# EAGLE design r1 (EAGLE 5.06)
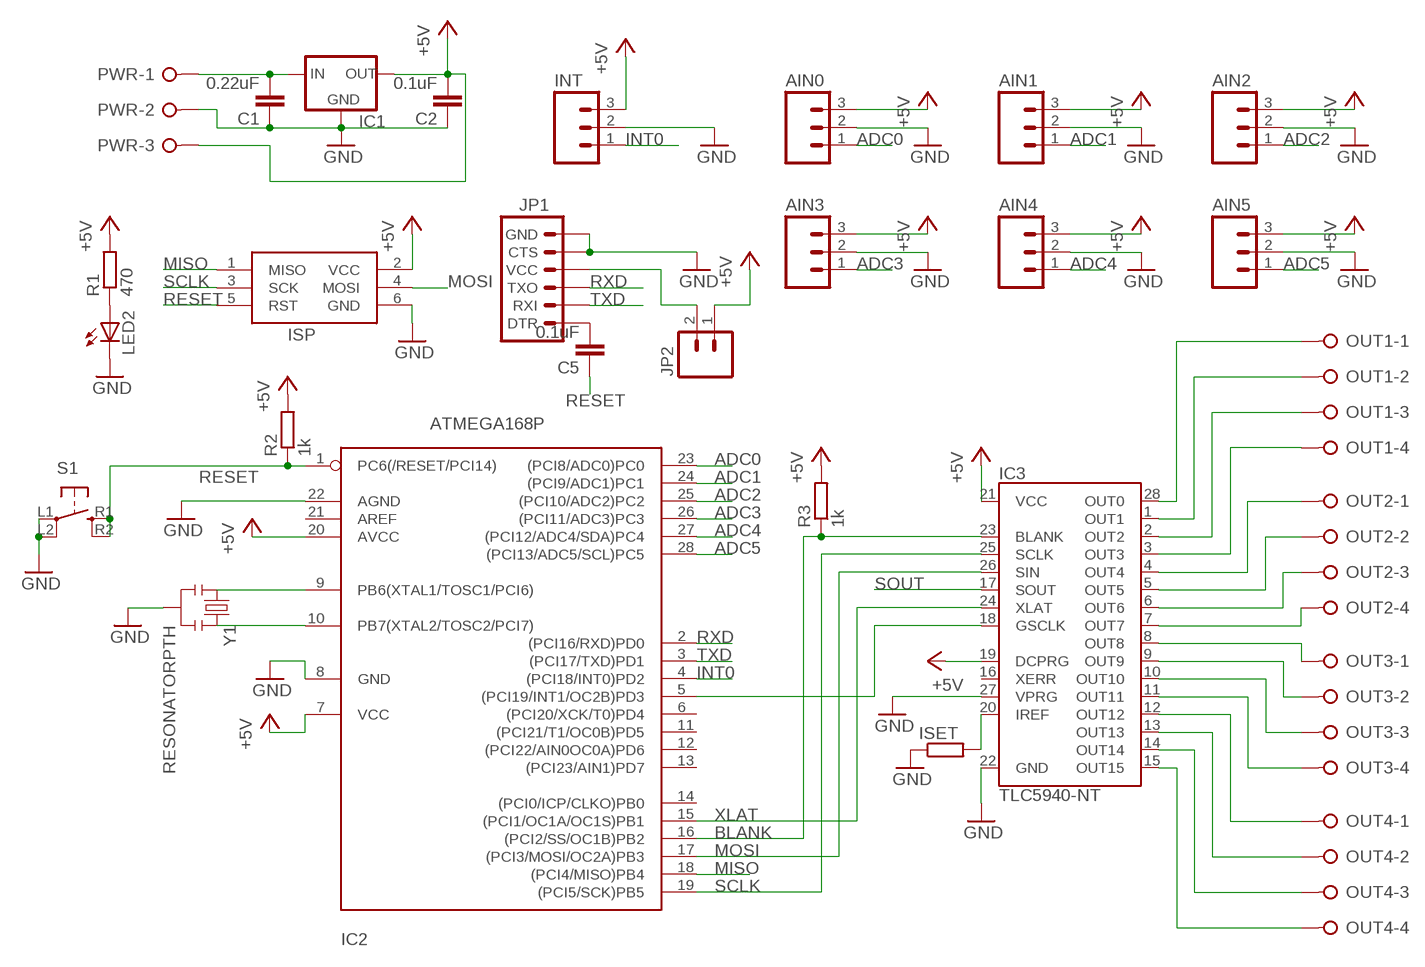
[diagram p0: schematic, sheet 1]

## Parts
AIN0  M03PTH  [1X03]
AIN1  M03PTH  [1X03]
AIN2  M03PTH  [1X03]
AIN3  M03PTH  [1X03]
AIN4  M03PTH  [1X03]
AIN5  M03PTH  [1X03]
C1  0.22uF  C-EU050-025X075  [C050-025X075]
C2  0.1uF  C-EU050-025X075  [C050-025X075]
C5  0.1uF  C-EU050-025X075  [C050-025X075]
IC1  V_REG_78XXSINK  [TO220-IGO]
IC2  ATMEGA168P  [X-DIL28-3]
IC3  TLC5940-NT  [X-DIL28-3]
INT  M03PTH  [1X03]
ISET  R-EU_0204/7  [0204/7]
ISP  AVRISP-6  [AVRISP]
JP1  ARDUINO_SERIAL_PROGRAMPTH  [1X06]
JP2  M02LOCK  [1X02_LOCK]
LED2  LED5MM  [LED5MM]
OUT1  W237-04P  [W237-4P]
OUT2  W237-04P  [W237-4P]
OUT3  W237-04P  [W237-4P]
OUT4  W237-04P  [W237-4P]
PWR  W237-03P  [W237-133]
R1  470  R-EU_0204/7  [0204/7]
R2  1k  R-EU_0204/7  [0204/7]
R3  1k  R-EU_0204/7  [0204/7]
S1  SWITCH-MOMENTARY-2PTH  [TACTILE-PTH]
Y1  RESONATORPTH  [RESONATOR-PTH]

## Nets
+5V: AIN0.3 AIN1.3 AIN2.3 AIN3.3 AIN4.3 AIN5.3 C2.2 IC1.OUT IC2.7(VCC) IC2.20(AVCC) IC3.19(DCPRG) IC3.21(VCC) INT.3 ISP.2(VCC) JP2.1 PWR.3 R1.2 R2.2 R3.2
ADC0: AIN0.1 IC2.23((PCI8/ADC0)PC0)
ADC1: AIN1.1 IC2.24((PCI9/ADC1)PC1)
ADC2: AIN2.1 IC2.25((PCI10/ADC2)PC2)
ADC3: AIN3.1 IC2.26((PCI11/ADC3)PC3)
ADC4: AIN4.1 IC2.27((PCI12/ADC4/SDA)PC4)
ADC5: AIN5.1 IC2.28((PCI13/ADC5/SCL)PC5)
BLANK: IC2.16((PCI2/SS/OC1B)PB2) IC3.23(BLANK) R3.1
GND: AIN0.2 AIN1.2 AIN2.2 AIN3.2 AIN4.2 AIN5.2 C1.1 C2.1 IC1.GND IC2.8(GND) IC2.22(AGND) IC3.22(GND) IC3.27(VPRG) INT.2 ISET.1 ISP.6(GND) JP1.5(CTS) JP1.6(GND) LED2.K(C) PWR.2 S1.L1 S1.L2 Y1.2
GSCLK: IC2.5((PCI19/INT1/OC2B)PD3) IC3.18(GSCLK)
INT0: IC2.4((PCI18/INT0)PD2) INT.1
MISO: IC2.18((PCI4/MISO)PB4) ISP.1(MISO)
MOSI: IC2.17((PCI3/MOSI/OC2A)PB3) IC3.26(SIN) ISP.4(MOSI)
N$1: C5.2 JP1.1(DTR)
N$2: C1.2 IC1.IN PWR.1
N$3: IC2.9(PB6(XTAL1/TOSC1/PCI6)) Y1.1
N$4: IC2.10(PB7(XTAL2/TOSC2/PCI7)) Y1.3
N$5: LED2.A R1.1
N$6: IC3.3(OUT3) OUT1.4
N$7: JP1.4(VCC) JP2.2
N$8: IC3.2(OUT2) OUT1.3
N$9: IC3.1(OUT1) OUT1.2
N$12: IC3.20(IREF) ISET.2
N$13: IC3.28(OUT0) OUT1.1
N$14: IC3.8(OUT8) OUT3.1
N$15: IC3.9(OUT9) OUT3.2
N$16: IC3.10(OUT10) OUT3.3
N$17: IC3.11(OUT11) OUT3.4
N$18: IC3.7(OUT7) OUT2.4
N$19: IC3.6(OUT6) OUT2.3
N$20: IC3.5(OUT5) OUT2.2
N$21: IC3.4(OUT4) OUT2.1
N$22: IC3.12(OUT12) OUT4.1
N$23: IC3.13(OUT13) OUT4.2
N$24: IC3.14(OUT14) OUT4.3
N$25: IC3.15(OUT15) OUT4.4
RESET: C5.1 IC2.1(PC6(/RESET/PCI14)) ISP.5(RST) R2.1 S1.R1 S1.R2
RXD: IC2.2((PCI16/RXD)PD0) JP1.3(TXO)
SCLK: IC2.19((PCI5/SCK)PB5) IC3.25(SCLK) ISP.3(SCK)
SOUT: IC3.17(SOUT)
TXD: IC2.3((PCI17/TXD)PD1) JP1.2(RXI)
XLAT: IC2.15((PCI1/OC1A/OC1S)PB1) IC3.24(XLAT)
Unconnected: IC2.6((PCI20/XCK/T0)PD4) IC2.11((PCI21/T1/OC0B)PD5) IC2.12((PCI22/AIN0OC0A)PD6) IC2.13((PCI23/AIN1)PD7) IC2.14((PCI0/ICP/CLKO)PB0) IC2.21(AREF) IC3.16(XERR)

## Library data of the parts
AIN0 AIN1-AIN5 INT = SparkFun:M03: Header 3 Standard 3-pin 0.1" header. Use with straight break away headers (SKU : PRT-00116), right angle break away headers (PRT-00553), swiss pins (PRT-00743), machine pins (PRT-00117), and female headers (PRT-00115). Molex polarized connector foot print use with SKU : PRT-08232 with associated crimp pins and housings.
C1 C2 C5 = rcl:C-EU: CAPACITOR, European symbol
IC1 = a-new-library:V_REG_78XX: Voltage Regulator Standard 7805 5V regulator. IGO (Input Ground Output). Spark Fun Electronics SKU : COM-00107
IC2 = a-new-library:ATMEGA168*P: MICROCONTROLLER 16 kBytes FLASH 1 kBytes SRAM 512 Bytes EEPROM USART 8-channel 10 bit ADC
IC3 = a-new-library:TLC5940: TI TLC5940 16-channel LED Driver with Dot Correction and Grayscale PWM Control The TLC5940 is a 16-channel, constant-current sink LED driver. Each channel has an individually adjustable 4096-step grayscale PWM brightness control and a 64-step, constant-current sink (dot correction). The dot correction adjusts the brightness variations between LED channels and other LED drivers. The dot correction data is stored in an integrated EEPROM. Both grayscale control and dot correction are accessible via a serial interface. A single external resistor sets the maximum current value of all 16 channels. Packages: 28-pin HTSSOP 32-pin 5x5mm QFN 28-pin DIP
ISET R1-R3 = rcl:R-EU_: RESISTOR, European symbol
ISP = adafruit:AVRISP: AVR ISP HEADER Standard 6 pin header for AVR programming
JP1 = SparkFun:ARDUINO_SERIAL_PROGRAM
JP2 = a-new-library:M02: Header 2 Standard 2-pin 0.1" header. Use with straight break away headers (SKU : PRT-00116), right angle break away headers (PRT-00553), swiss pins (PRT-00743), machine pins (PRT-00117), and female headers (PRT-00115). Molex polarized connector foot print use with SKU : PRT-08233 with associated crimp pins and housings.
LED2 = SparkFun:LED: LEDs Standard schematic elements and footprints for 5mm, 3mm, 1206, and 0603 sized LEDs. 5mm - Spark Fun Electronics SKU : COM-00529 (and others)
OUT1-OUT4 = a-new-library:W237-04P: WAGO SREW CLAMP; OC_FARNELL: unknown; OC_NEWARK: unknown
PWR = con-wago-508:W237-03P: WAGO SREW CLAMP; OC_FARNELL: unknown; OC_NEWARK: unknown
S1 = a-new-library:SWITCH-MOMENTARY-2
Y1 = SparkFun:RESONATOR: Resonator Small SMD resonator. This is the itty bitty 10/20MHz resonators with built in caps. CSTCE10M0G55 and CSTCE20M0V53. Footprint has been reviewed closely but hasn't been tested yet.

## Board
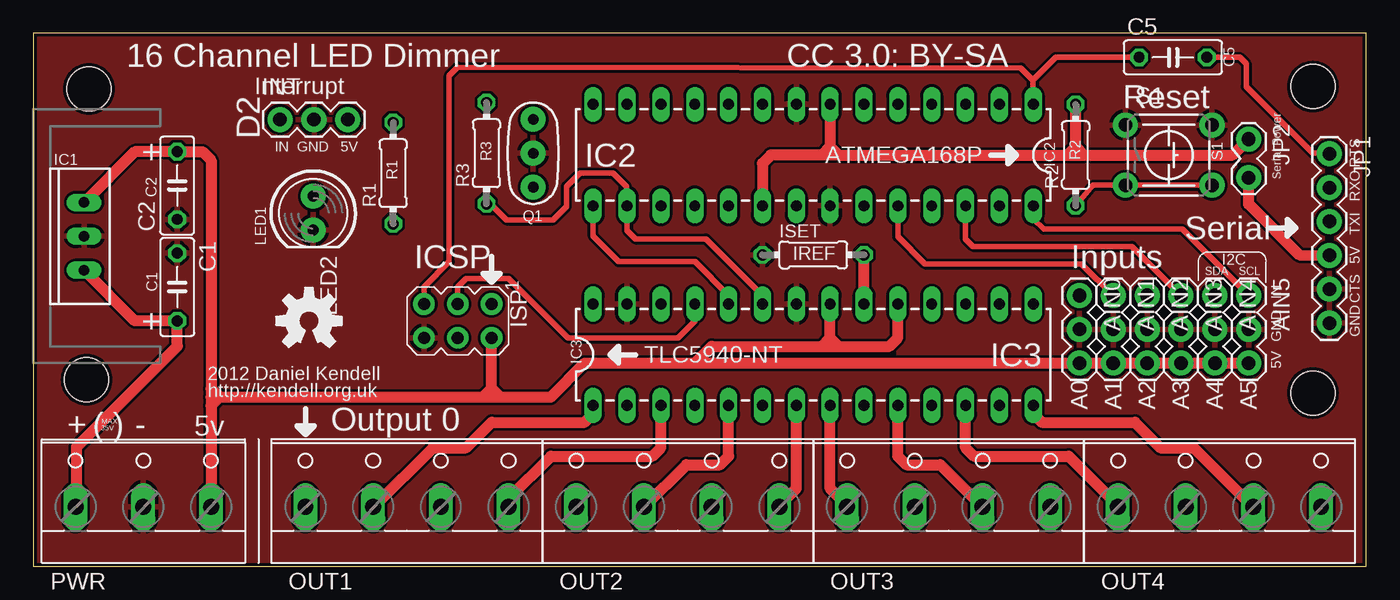
[diagram p1: board, top side]
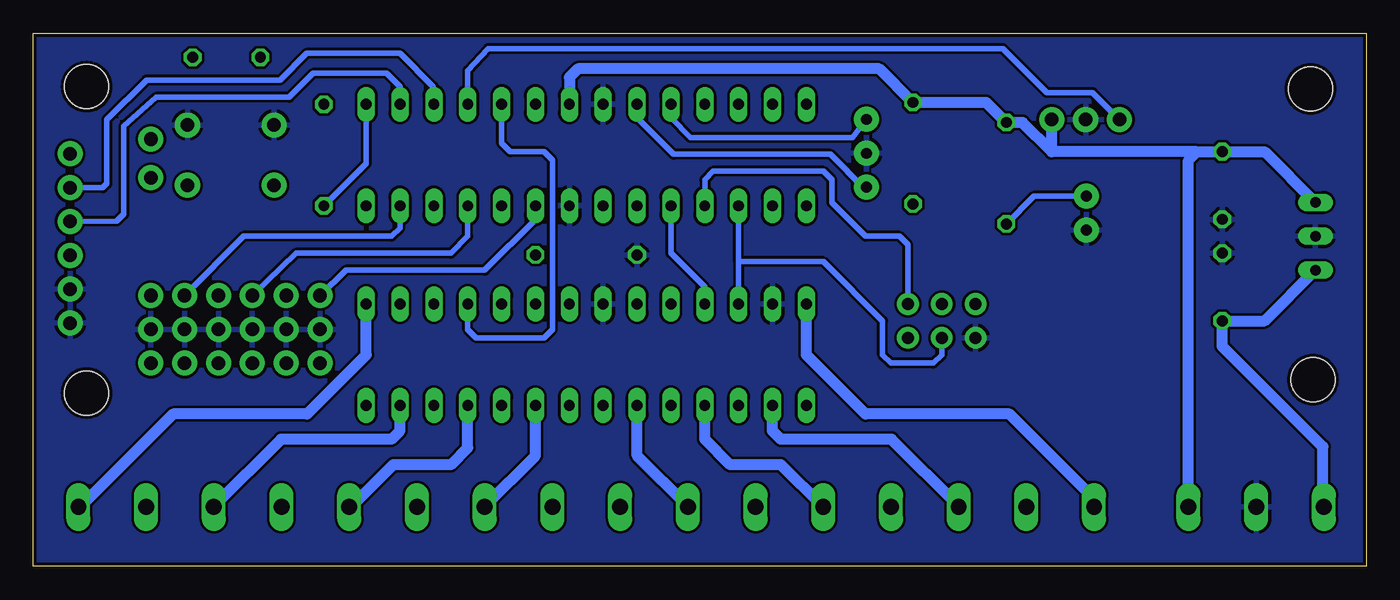
[diagram p2: board, bottom side, seen from below]

Size 100 x 40 mm. Coordinates in mm from the lower left corner, seen from the top.
Outline: 0,0 100,0 100,40 0,39.99 0,0
Copper layers (1*16): Top 0.035mm / dielectric 1.5mm / Bottom 0.035mm
Design rules "pcbtrain": minimum track width 0.2mm, minimum drill 0.4mm, track to track 0.2mm, track to pad 0.2mm, pad to pad 0.2mm, via to via 0.2mm, smd to smd 0mil, copper to edge 10mil, drill to drill 0.2mm, minimum pad ring 10mil, minimum via ring 10mil, stop-mask expansion 0.125mm, vias tented up to drill 0mil, thermal gap 10mil

### Footprints (pad centres in the part's own frame; a part is rotated, then mirrored left to right if it is on the bottom)
1X03 = drill 1.016 pad 1.88 round: 1 0,0; 2 2.54,0; 3 5.08,0
C050-025X075 = drill 0.813 octagon: 1 -2.54,0; 2 2.54,0
TO220-IGO = drill 0.8 long: GND 0,0; IN -2.54,0; OUT 2.54,0
X-DIL28-3 = drill 0.813 long: 1 -16.51,-3.81; 2 -13.97,-3.81; 3 -11.43,-3.81; 4 -8.89,-3.81; 5 -6.35,-3.81; 6 -3.81,-3.81; 7 -1.27,-3.81; 8 1.27,-3.81; 9 3.81,-3.81; 10 6.35,-3.81; 11 8.89,-3.81; 12 11.43,-3.81; 13 13.97,-3.81; 14 16.51,-3.81; 15 16.51,3.81; 16 13.97,3.81; 17 11.43,3.81; 18 8.89,3.81; 19 6.35,3.81; 20 3.81,3.81; 21 1.27,3.81; 22 -1.27,3.81; 23 -3.81,3.81; 24 -6.35,3.81; 25 -8.89,3.81; 26 -11.43,3.81; 27 -13.97,3.81; 28 -16.51,3.81
0204/7 = drill 0.813 octagon: 1 -3.81,0; 2 3.81,0
AVRISP = drill 0.9 pad 1.626 round: 1 -1.27,2.54; 2 1.27,2.54; 3 -1.27,0; 4 1.27,0; 5 -1.27,-2.54; 6 1.27,-2.54
1X06 = drill 1.016 pad 1.88 round: 1 0,0; 2 2.54,0; 3 5.08,0; 4 7.62,0; 5 10.16,0; 6 12.7,0
1X02_LOCK = drill 1.016 pad 1.88 round: 1 -0.178,0; 2 2.718,0
LED5MM = drill 0.813 pad 1.88 round: A -1.27,0; K 1.27,0
W237-4P = drill 1.194 long: 1 -7.62,-0.635; 2 -2.54,-0.635; 3 2.54,-0.635; 4 7.62,-0.635
W237-133 = drill 1.194 long: 1 -5.08,-0.635; 2 0,-0.635; 3 5.08,-0.635
TACTILE-PTH = drill 1.016 pad 1.88 round: L1 -2.261,3.251; L2 -2.261,-3.251; R1 2.261,3.251; R2 2.261,-3.251
STAND-OFF = hole 3.302: 0,0
RESONATOR-PTH = drill 0.8 pad 1.88 round: 1 -2.54,0; 2 0,0; 3 2.54,0

### Placement (x,y rotation side)
AIN0  78.49,20.32 270 top
AIN1  81.03,20.32 270 top
AIN2  83.57,20.32 270 top
AIN3  86.11,20.32 270 top
AIN4  88.65,20.32 270 top
AIN5  91.19,20.32 270 top
C1  10.79,20.95 270 top
C2  10.79,28.57 90 top
C5  85.5,38.2 0 top
IC1  3.81,24.77 90 top
IC2  58.52,30.86 180 top
IC3  58.52,15.88 0 top
INT  18.51,33.53 0 top
ISET  58.52,23.37 0 top
ISP  31.84,18.41 270 top
JP1  97.24,30.95 270 top
JP2  91.19,31.88 270 top
LED2  21,26.5 270 top
OUT1  28.04,5.08 0 top
OUT2  48.35,5.08 0 top
OUT3  68.67,5.08 0 top
OUT4  89,5.08 0 top
PWR  8.26,5.08 0 top
R1  27,29.5 90 top
R2  78.2,30.86 90 top
R3  34,31 90 top
S1  85.19,30.86 270 top
U$1  [OSHW-LOGO-M]  20.68,18.41 0 top
U$2  [STAND-OFF]  96,13 0 top
U$3  [STAND-OFF]  4,14 0 top
U$4  [STAND-OFF]  4.17,35.83 0 top
U$5  [STAND-OFF]  96,36 0 top
Y1  37.5,31 90 top

### Tracks (layer width: path | path; a pad name or v marks a point on that pad's centre or on a via)
+5V
  Top 0.813: 78.2,31.5 R2.2 | 77.56,30.86 78.2,31.5 | 60.42,30.86 77.56,30.86 | 59.78,31.5 60.42,30.86 | 59.15,30.86 55.34,30.86 54.7,30.23 IC2.20 | 59.78,31.5 59.15,30.86 | IC2.7 59.78,31.5 | IC1.OUT 7.62,31.11 C2.2 12.7,31.11 13.34,30.48 13.34,13.34 | AIN5.3 AIN4.3 AIN3.3 AIN2.3 AIN1.3 AIN0.3 49.62,15.24 | 49.62,15.24 41.37,15.24 38.83,12.7 35.02,12.7 | 13.34,12.7 13.97,12.7 | 13.97,12.7 33.75,12.7 | 33.75,12.7 34.38,12.7 | 34.38,12.7 35.02,12.7 | 13.34,12.06 13.34,4.5 | 13.34,12.7 13.34,12.06 | 13.34,13.34 13.34,12.7 | 59.78,17.14 IC3.21 | 59.15,16.51 50.9,16.51 49.62,15.24 | 59.15,16.51 59.78,17.14 | 59.78,17.14 60.42,16.51 | 60.42,16.51 64.23,16.51 64.86,17.14 IC3.19 | 34.38,12.7 34.38,13.34 | 34.38,13.34 ISP.2 | 13.97,12.7 13.34,12.06 | 13.34,13.34 13.97,12.7 | 33.75,12.7 34.38,13.34 | 34.38,13.34 35.02,12.7 | 59.15,16.51 60.42,16.51 | 60.42,30.86 59.15,30.86 | 78.2,31.5 78.83,30.86 | 77.56,30.86 78.83,30.86 | 78.83,30.86 89.99,30.86 JP2.1
  Bottom 0.813: 12.7,31.11 C2.2 7.62,31.11 IC1.OUT | IC2.7 59.78,36.7 59.15,37.34 36.53,37.34 R3.2 28.5,34.81 R1.2 25.79,33.31 23.59,31.11 | 12.7,31.11 13.34,30.48 PWR.3 | 23.59,31.11 INT.3 | 12.7,31.11 23.59,31.11
ADC0
  Bottom 0.406: AIN0.1 76.54,22.23 66.14,22.23 62.33,26.04 IC2.23
ADC1
  Top 0.406: IC2.24 64.86,24.73 66.9,22.7 78.65,22.7 AIN1.1
ADC2
  Bottom 0.406: AIN2.1 80.26,23.5 68.67,23.5 67.41,24.77 IC2.25
ADC3
  Top 0.406: IC2.26 69.94,24.55 70.5,24 82.43,24 AIN3.1
ADC4
  Bottom 0.406: AIN4.1 84.2,24.77 73.12,24.77 72.48,25.4 IC2.27
ADC5
  Top 0.406: IC2.28 75.03,26.07 75.8,25.3 86.21,25.3 AIN5.1
BLANK
  Top 0.406: IC3.23 54.7,20.32 50.46,24.57 45.18,24.57 44.55,25.2 IC2.16 44.5,27.1 44.5,28.5 43.5,29.5 41,29.5 40,28.5 40,27 39,26 35.5,26 34.31,27.19 R3.1
GND
  pour Bottom: 0,40.01 0,0 100,0 100,40
  pour Top: 0,40.01 100,40 100,0 0,0
GSCLK
  Bottom 0.406: IC3.18 67.41,17.78 66.77,17.14 61.69,17.14 61.05,17.78 61.05,30.48 61.69,31.11 64.23,31.11 64.86,31.75 IC2.5
INT0
  Bottom 0.406: IC2.4 67.41,37.21 65.88,38.86 27.27,38.86 23.97,35.56 20.54,35.56 INT.1
MISO
  Bottom 0.406: ISP.1 34.38,24.13 35.02,24.77 37.56,24.77 40.1,27.3 40.1,29.01 40.73,29.64 48.99,29.64 49.62,29.01 IC2.18
MOSI
  Bottom 0.406: ISP.4 31.84,15.88 32.48,15.24 35.66,15.24 36.29,15.88 36.29,18.41 40.73,22.86 47.09,22.86 | 47.09,22.86 IC3.26 | 47.09,22.86 IC2.17
N$1
  Top 0.406: C5.2 90.5,38.2 91,37.7 91,36 96.01,30.99 97.28,30.99 JP1.1
N$2
  Top 0.813: IC1.IN 7.62,18.41 C1.2 10.79,16.51 3.25,8.97 3.25,4.53 PWR.1
  Bottom 0.813: IC1.IN 7.62,18.41 C1.2 10.79,16.51 3.25,8.97 3.25,4.53 PWR.1
N$3
  Bottom 0.406: IC2.9 54.7,33.66 51.97,30.91 40.2,30.91 37.64,28.36 Y1.1
N$4
  Bottom 0.406: IC2.10 52.16,33.66 50.7,32.19 38.55,32.19 Y1.3
N$5
  Bottom 0.406: LED2.A 24.92,27.77 R1.1
N$6
  Top 0.813: IC3.3 47.09,8.89 46.45,8.26 38.83,8.26 35.66,5.08 OUT1.4
N$7
  Top 0.813: JP2.2 91.19,27.18 95,23.37 JP1.4
N$8
  Bottom 0.813: IC3.2 44.55,10.16 43.91,9.53 35.62,9.53 30.57,4.49 OUT1.3
N$9
  Top 0.813: IC3.1 42.01,11.43 41.37,10.79 34.38,10.79 32.48,8.89 29.98,8.89 25.54,4.45 OUT1.2
N$12
  Top 0.813: IC3.20 ISET.2
N$13
  Bottom 0.813: IC3.28 42.01,15.88 37.56,11.43 26.77,11.43 20.41,5.08 OUT1.1
N$14
  Top 0.813: IC3.8 59.78,5.83 61.05,4.57 OUT3.1
N$15
  Bottom 0.813: IC3.9 62.33,8.29 66.14,4.49 OUT3.2
N$16
  Top 0.813: IC3.10 64.86,8.26 65.5,7.62 68.04,7.62 OUT3.3
N$17
  Bottom 0.813: IC3.11 67.41,8.89 68.67,7.62 73,7.62 76.17,4.45 OUT3.4
N$18
  Top 0.813: IC3.7 57.24,5.83 55.98,4.57 OUT2.4
N$19
  Bottom 0.813: IC3.6 54.7,8.29 50.9,4.49 OUT2.3
N$20
  Top 0.813: IC3.5 52.16,8.26 51.53,7.62 48.99,7.62 OUT2.2
N$21
  Bottom 0.813: IC3.4 49.62,9.53 47.72,7.62 43.91,7.62 OUT2.1
N$22
  Top 0.813: IC3.12 69.94,8.89 70.58,8.26 77.69,8.26 81.38,4.57 OUT4.1
N$23
  Bottom 0.813: IC3.13 72.48,10.16 73.12,9.53 81.42,9.53 86.45,4.49 OUT4.2
N$24
  Top 0.813: IC3.14 75.03,11.43 75.66,10.79 82.64,10.79 84.55,8.89 87.05,8.89 91.5,4.45 OUT4.3
N$25
  Bottom 0.813: IC3.15 75.03,15.88 79.47,11.43 89.51,11.43 96.5,4.45 OUT4.4
RESET
  Top 0.406: 75,36.5 74.1,37.4 31.84,37.47 31.21,36.83 31.21,22.86 29.3,20.95 ISP.5 | 75,36.5 IC2.1 | R2.1 79.5,28.6 S1.R2 S1.R1 | C5.1 76.7,38.2 75,36.5
  Bottom 0.406: R2.1 75.03,30.23 IC2.1
RXD
  Bottom 0.406: IC2.2 72.5,36 73.5,37 79,37 80.8,35.2 90.8,35.2 93.22,33.02 93.22,26.42 93.73,25.91 JP1.3
SCLK
  Top 0.406: ISP.3 31.84,20.95 32.48,21.59 35.66,21.59 40.1,17.14 48.35,17.14 49.62,18.41 IC3.25
  Bottom 0.406: IC3.25 49.62,20.95 52.16,23.5 IC2.19
TXD
  Bottom 0.406: IC2.3 70,36 72.5,38.5 79.5,38.5 81.5,36.5 91.5,36.5 94.49,33.53 94.49,28.7 94.78,28.41 JP1.2
XLAT
  Top 0.406: IC2.15 42.01,24.77 43.91,22.86 49.62,22.86 52.16,20.32 IC3.24

### Text on the board
tPlace: 16 Channel LED Dimmer | CC 3.0: BY-SA | C5 | Interrupt | Reset | Serial Power | D2 | IN | GND | 5V | IC1 | + | R3 | IC2 | R2 | S1 | RTS | R1 | C2 | RXO | Q1 | Serial | TXI | LED1 | ICSP | IREF | I2C | 5V | C1 | Inputs | SDA | SCL | IN | CTS | + | IC3 | GND | GND | 5V | 2012 Daniel Kendell | A0 | A1 | A2 | A3 | A4 | A5 | http://kendell.org.uk | MAX | + | ( | 35V | ) | - | 5v | Output 0